# Altium schematic sheet BusControl.SCHDOC
size B
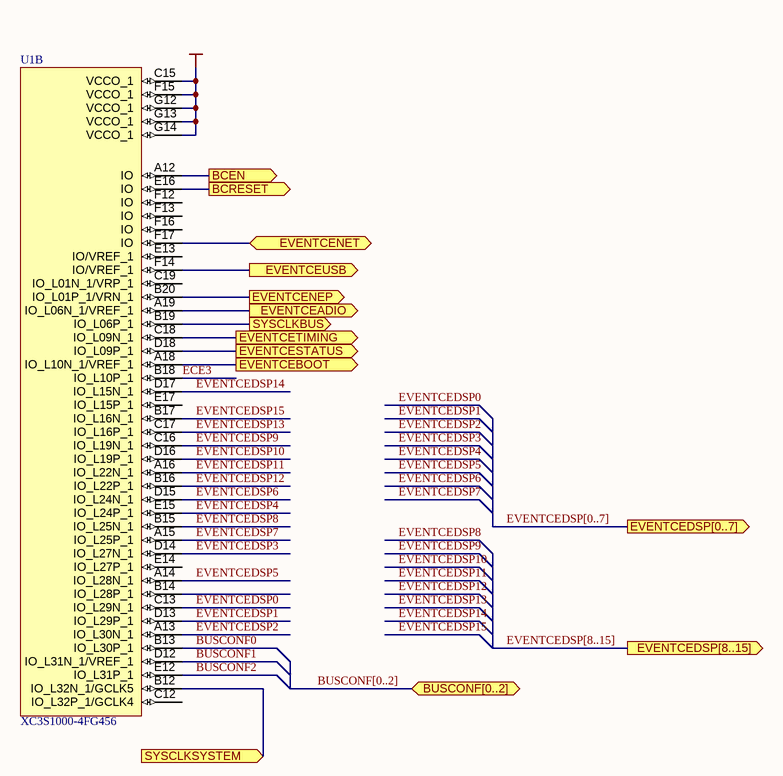
[diagram p0: BusControl.SCHDOC]

## Parts
U1  XC3S1000-4FG456  [FG456]  (part B of 9)

## Ports
BCEN (out), BCRESET (out), BUSCONF[0..2] (bidir), EVENTCEADIO (out), EVENTCEBOOT (out), EVENTCEDSP[0..7] (out), EVENTCEDSP[8..15] (out), EVENTCENEP (out), EVENTCENET (bidir), EVENTCESTATUS (out), EVENTCETIMING (out), EVENTCEUSB (out), SYSCLKBUS (out), SYSCLKSYSTEM (in)

## Nets
VCC: U1.C15(VCCO_1) U1.F15(VCCO_1) U1.G12(VCCO_1) U1.G13(VCCO_1) U1.G14(VCCO_1)
BCEN: U1.A12(IO) ; port BCEN
BCRESET: U1.E16(IO) ; port BCRESET
BUSCONF0: U1.B13(IO_L30P_1)
BUSCONF1: U1.D12(IO_L31N_1/VREF_1)
BUSCONF2: U1.E12(IO_L31P_1)
ECE3: U1.B18(IO_L10P_1)
EVENTCEADIO: U1.A19(IO_L06N_1/VREF_1) ; port EVENTCEADIO
EVENTCEBOOT: U1.A18(IO_L10N_1/VREF_1) ; port EVENTCEBOOT
EVENTCEDSP0: U1.C13(IO_L29N_1)
EVENTCEDSP1: U1.D13(IO_L29P_1)
EVENTCEDSP2: U1.A13(IO_L30N_1)
EVENTCEDSP3: U1.D14(IO_L27N_1)
EVENTCEDSP4: U1.E15(IO_L24P_1)
EVENTCEDSP5: U1.A14(IO_L28N_1)
EVENTCEDSP6: U1.D15(IO_L24N_1)
EVENTCEDSP7: U1.A15(IO_L25P_1)
EVENTCEDSP8: U1.B15(IO_L25N_1)
EVENTCEDSP9: U1.C16(IO_L19N_1)
EVENTCEDSP10: U1.D16(IO_L19P_1)
EVENTCEDSP11: U1.A16(IO_L22N_1)
EVENTCEDSP12: U1.B16(IO_L22P_1)
EVENTCEDSP13: U1.C17(IO_L16P_1)
EVENTCEDSP14: U1.D17(IO_L15N_1)
EVENTCEDSP15: U1.B17(IO_L16N_1)
EVENTCENEP: U1.B20(IO_L01P_1/VRN_1) ; port EVENTCENEP
EVENTCENET: U1.F17(IO) ; port EVENTCENET
EVENTCESTATUS: U1.D18(IO_L09P_1) ; port EVENTCESTATUS
EVENTCETIMING: U1.C18(IO_L09N_1) ; port EVENTCETIMING
EVENTCEUSB: U1.F14(IO/VREF_1) ; port EVENTCEUSB
SYSCLKBUS: U1.B19(IO_L06P_1) ; port SYSCLKBUS
SYSCLKSYSTEM: U1.B12(IO_L32N_1/GCLK5) ; port SYSCLKSYSTEM

Not connected (* = marked no-connect by the designer): U1 B14(IO_L28P_1) C12(IO_L32P_1/GCLK4) C19(IO_L01N_1/VRP_1) E13(IO/VREF_1) E14(IO_L27P_1) E17(IO_L15P_1) F12(IO) F13(IO) F16(IO)

## Buses and harness runs
bus BUSCONF[0..2] = port BUSCONF[0..2]
bus EVENTCEDSP[0..7] = port EVENTCEDSP[0..7]
bus EVENTCEDSP[8..15] = port EVENTCEDSP[8..15]

## Notes on the sheet
- Title:
- Engineer:
- Date:
- Revision:
- Sheet
- of
- File:

## Library data of the parts
U1 = XC3S1000-4FG456: Xilinx Spartan-3 FPGA; Vendor: Xilinx